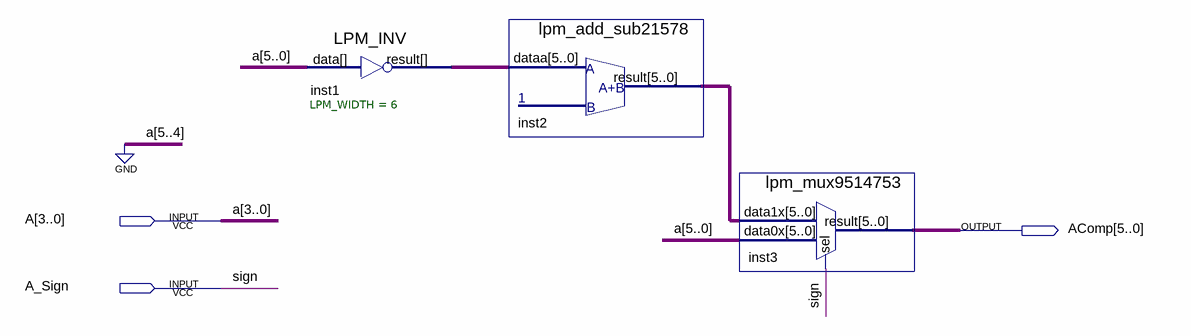
[diagram p0: schematic sheet]
// Quartus schematic TwosComp.bdf as structural Verilog: 3 symbols, 3 pins
module TwosComp (
  input  [3:0] A,
  input  A_Sign,
  output [5:0] AComp
);

  wire [5:0] inst1_result, inst2_result;

  LPM_INV #(.LPM_WIDTH(6)) inst1 (.data({2'b00, A}), .result(inst1_result));
  lpm_add_sub21578 inst2 (.dataa(inst1_result), .result(inst2_result));
  lpm_mux9514753 inst3 (.data1x(inst2_result), .data0x({2'b00, A}), .sel(A_Sign), .result(AComp));

  // Other names for the same wires on the sheet: sign = A_Sign
endmodule
